# EAGLE design Hahnentrittstulpe (EAGLE 6.5.0)
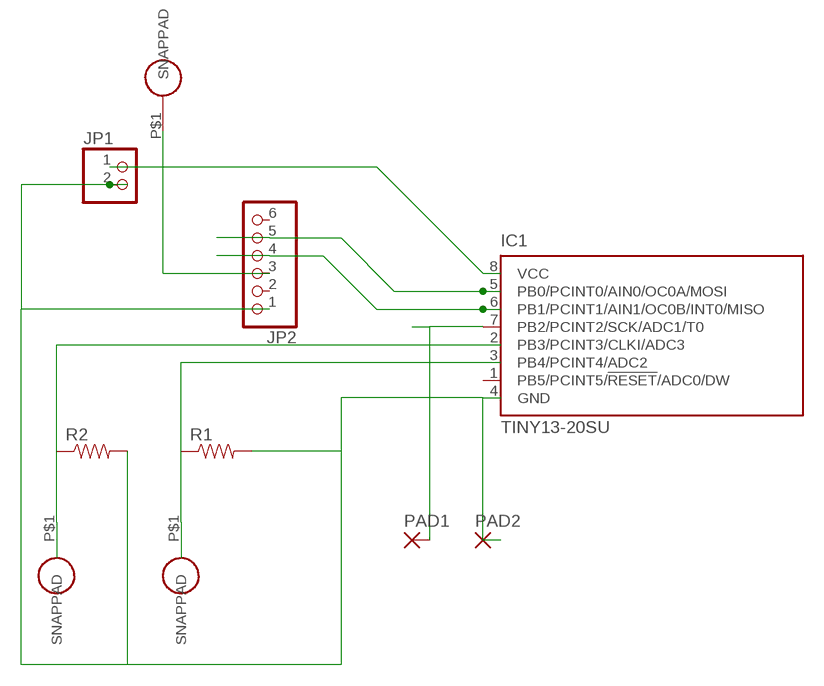
[diagram p0: schematic, sheet 1]

## Parts
IC1  TINY13-20SU  [8S2]
JP1  PINHD-1X2  [1X02]
JP2  PINHD-1X6/90  [1X06/90]
PAD1  SMD2  [SMD1,27-2,54]
PAD2  SMD2  [SMD1,27-2,54]
R1  RESISTOR0805-RES  [0805]
R2  RESISTOR0805-RES  [0805]
U$1  SNAP-PAD_7MM_ROUND  [SNAP-PAD_7MM_RD]
U$2  SNAP-PAD_7MM_ROUND  [SNAP-PAD_7MM_RD]
U$3  SNAP-PAD_7MM_ROUND  [SNAP-PAD_7MM_RD]

## Nets
N$2: IC1.3(PB4/PCINT4/ADC2) R1.1 U$1.P$1(SNAPPAD)
N$3: IC1.2(PB3/PCINT3/CLKI/ADC3) R2.1 U$2.P$1(SNAPPAD)
N$4: IC1.7(PB2/PCINT2/SCK/ADC1/T0) PAD1.1(P)
N$5: IC1.8(VCC) JP1.1 JP2.3 U$3.P$1(SNAPPAD)
N$6: IC1.6(PB1/PCINT1/AIN1/OC0B/INT0/MISO) JP2.4
N$7: IC1.5(PB0/PCINT0/AIN0/OC0A/MOSI) JP2.5
N$9: IC1.4(GND) JP1.2 JP2.1 PAD2.1(P) R1.2 R2.2
Unconnected: IC1.1(PB5/PCINT5/!RESET!/ADC0/DW) JP2.2 JP2.6

## Library data of the parts
IC1 = atmel:TINY13: 8-bit AVR Microcontroller with 1K Bytes In-System Programmable Flash Source: http://www.atmel.com/dyn/resources/prod_documents/2535S.pdf; MPN: ATTINY13-20SU; OC_FARNELL: 9171568; OC_NEWARK: 96K6522
JP1 = pinhead:PINHD-1X2: PIN HEADER
JP2 = pinhead:PINHD-1X6: PIN HEADER
PAD1 PAD2 = wirepad:SMD2: SMD PAD
R1 R2 = SparkFun-Resistors:RESISTOR: Resistor Basic schematic elements and footprints for 0603, 1206, and PTH resistors.
U$1-U$3 = hannahsEagleLib:SNAP-PAD_7MM_ROUND

## Board
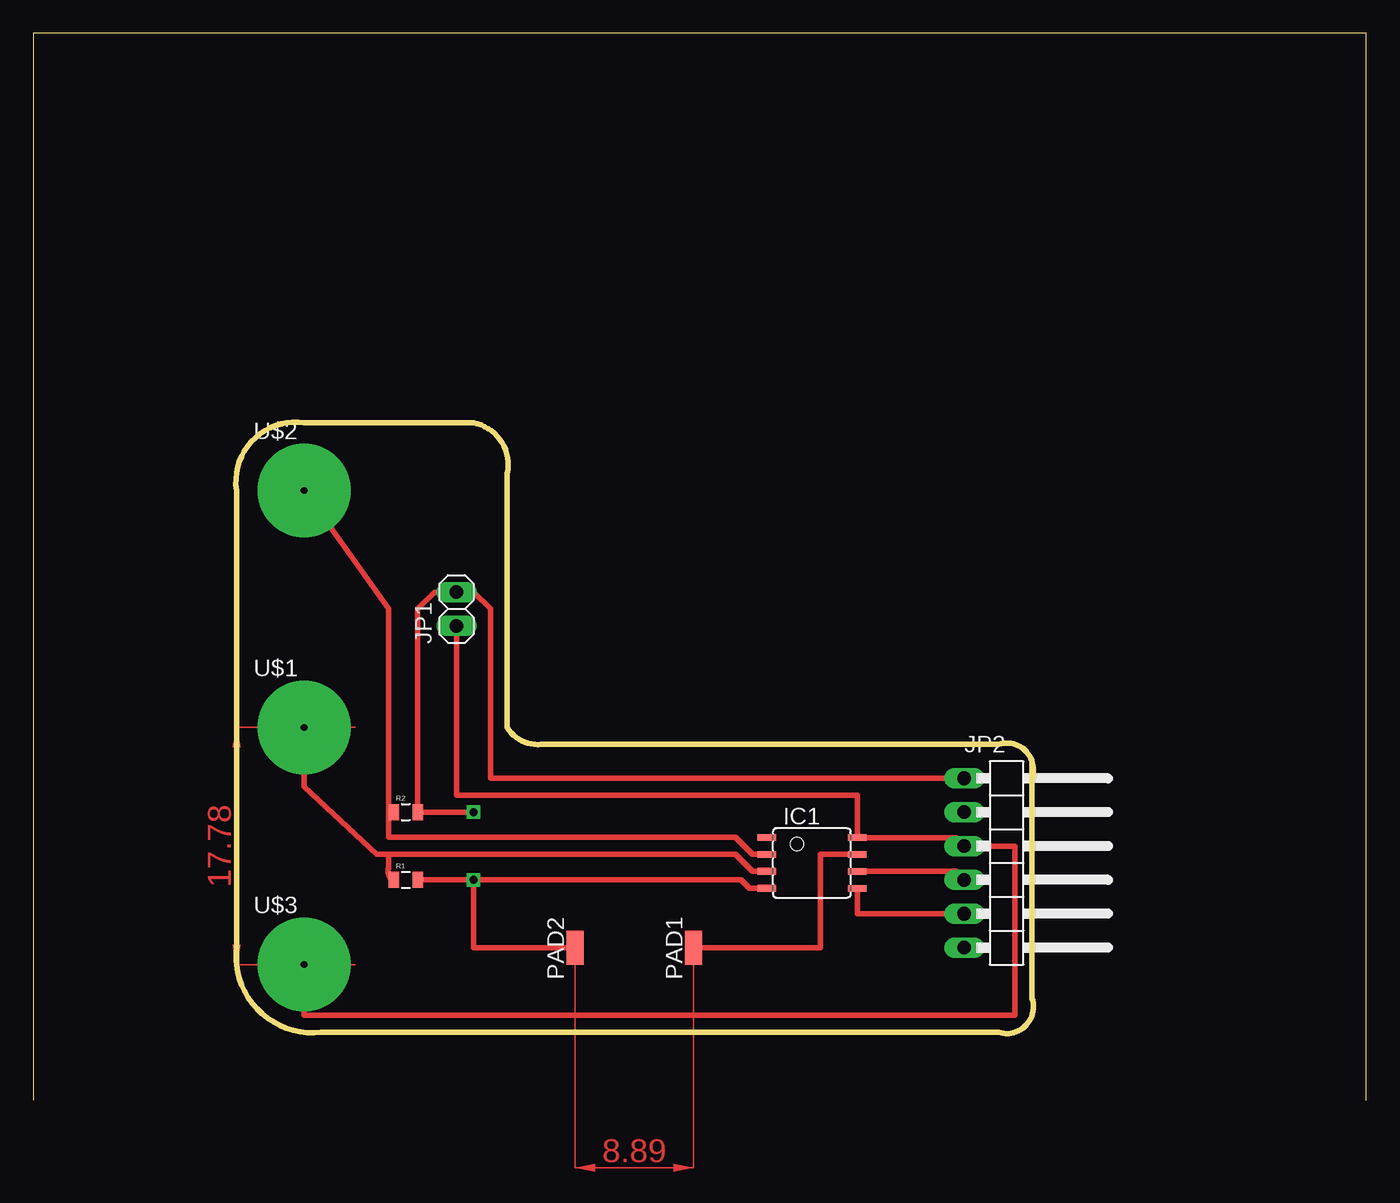
[diagram p1: board, top side]
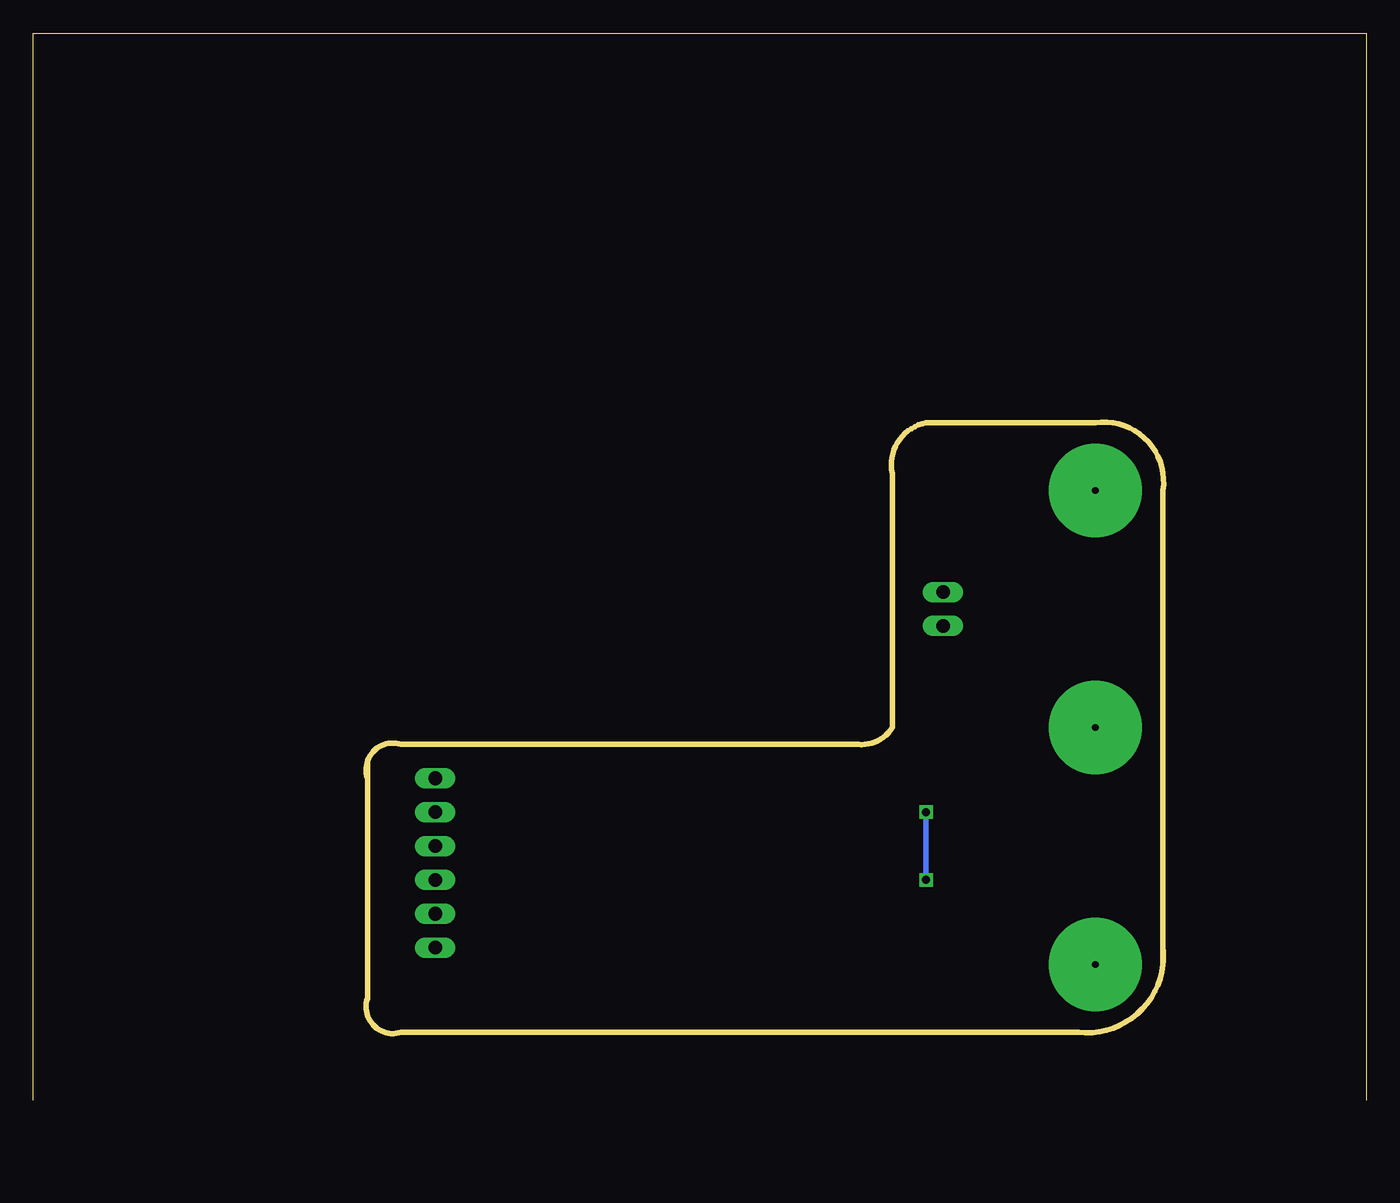
[diagram p2: board, bottom side, seen from below]

Size 100 x 80 mm. Coordinates in mm from the lower left corner, seen from the top.
Outline: 100,0 100,80 0,80 0,0
Copper layers (1*16): Top 0.035mm / dielectric 1.5mm / Bottom 0.035mm
Design rules "default": minimum track width 10mil, minimum drill 24mil, track to track 8mil, track to pad 8mil, pad to pad 8mil, via to via 8mil, smd to smd 8mil, copper to edge 40mil, drill to drill 8mil, minimum pad ring 10mil, minimum via ring 8mil, stop-mask expansion 4mil, vias tented up to drill 0mil, thermal gap 10mil
Milling: 15 lines

### Footprints (pad centres in the part's own frame; a part is rotated, then mirrored left to right if it is on the bottom)
8S2 = smd 0.5 x 1.4: 1 -1.905,-3.404; 2 -0.645,-3.404; 3 0.625,-3.404; 4 1.895,-3.404; 5 1.905,3.404; 6 0.635,3.404; 7 -0.635,3.404; 8 -1.905,3.404
1X02 = drill 1.016 long: 1 -1.27,0; 2 1.27,0
1X06/90 = drill 1.016 long: 1 -6.35,-3.81; 2 -3.81,-3.81; 3 -1.27,-3.81; 4 1.27,-3.81; 5 3.81,-3.81; 6 6.35,-3.81
SMD1,27-2,54 = smd 1.27 x 2.54: 1 0,0
0805 = smd 0.8 x 1.2: 1 -0.9,0; 2 0.9,0
SNAP-PAD_7MM_RD = drill 0.5 pad 7: P$1 0,0

### Placement (x,y rotation side)
IC1  58.42,17.78 270 top
JP1  31.75,36.83 90 top
JP2  73.66,17.78 270 top
PAD1  49.53,11.43 0 top
PAD2  40.64,11.43 0 top
R1  27.94,16.51 0 top
R2  27.94,21.59 0 top
U$1  20.32,27.94 0 top
U$2  20.32,45.72 0 top
U$3  20.32,10.16 0 top

### Tracks (layer width: path | path; a pad name or v marks a point on that pad's centre or on a via)
N$2
  Top 0.406: U$1.P$1 20.32,23.5 25.77,18.43 26.67,18.43 | R1.1 arc-90 26.67,17.41 26.67,18.43 | 26.67,18.43 52.7,18.43 53.97,17.16 IC1.3
N$3
  Top 0.406: 26.67,21.59 26.67,36.83 U$2.P$1 | 26.67,21.59 26.67,19.7 52.7,19.7 53.97,18.43 IC1.2 | R2.1 26.67,21.59
N$4
  Top 0.406: IC1.7 59.05,18.41 59.05,11.43 PAD1.1
N$5
  Top 0.406: JP1.1 31.75,22.86 61.82,22.86 IC1.8 69.22,19.68 JP2.3 73.66,19.05 73.66,6.35 20.32,6.35 U$3.P$1
N$6
  Top 0.406: JP2.4 69.22,17.14 IC1.6
N$7
  Top 0.406: JP2.5 61.82,13.97 IC1.5
N$9  (via drill 0.6)
  Top 0.406: v33.02,16.51 53.1,16.51 53.73,15.88 IC1.4 | JP2.1 34.29,24.13 34.29,36.83 33.02,38.1 JP1.2 30.11,38.1 28.84,36.83 R2.2 v33.02,21.59 | R1.2 v33.02,16.51 | v33.02,16.51 33.02,11.43 PAD2.1
  Bottom 0.406: v33.02,21.59 v33.02,16.51
(copper drawn outside any net)
  shapes: Top area x2